# EAGLE design qi-charger (EAGLE 9.6.2)
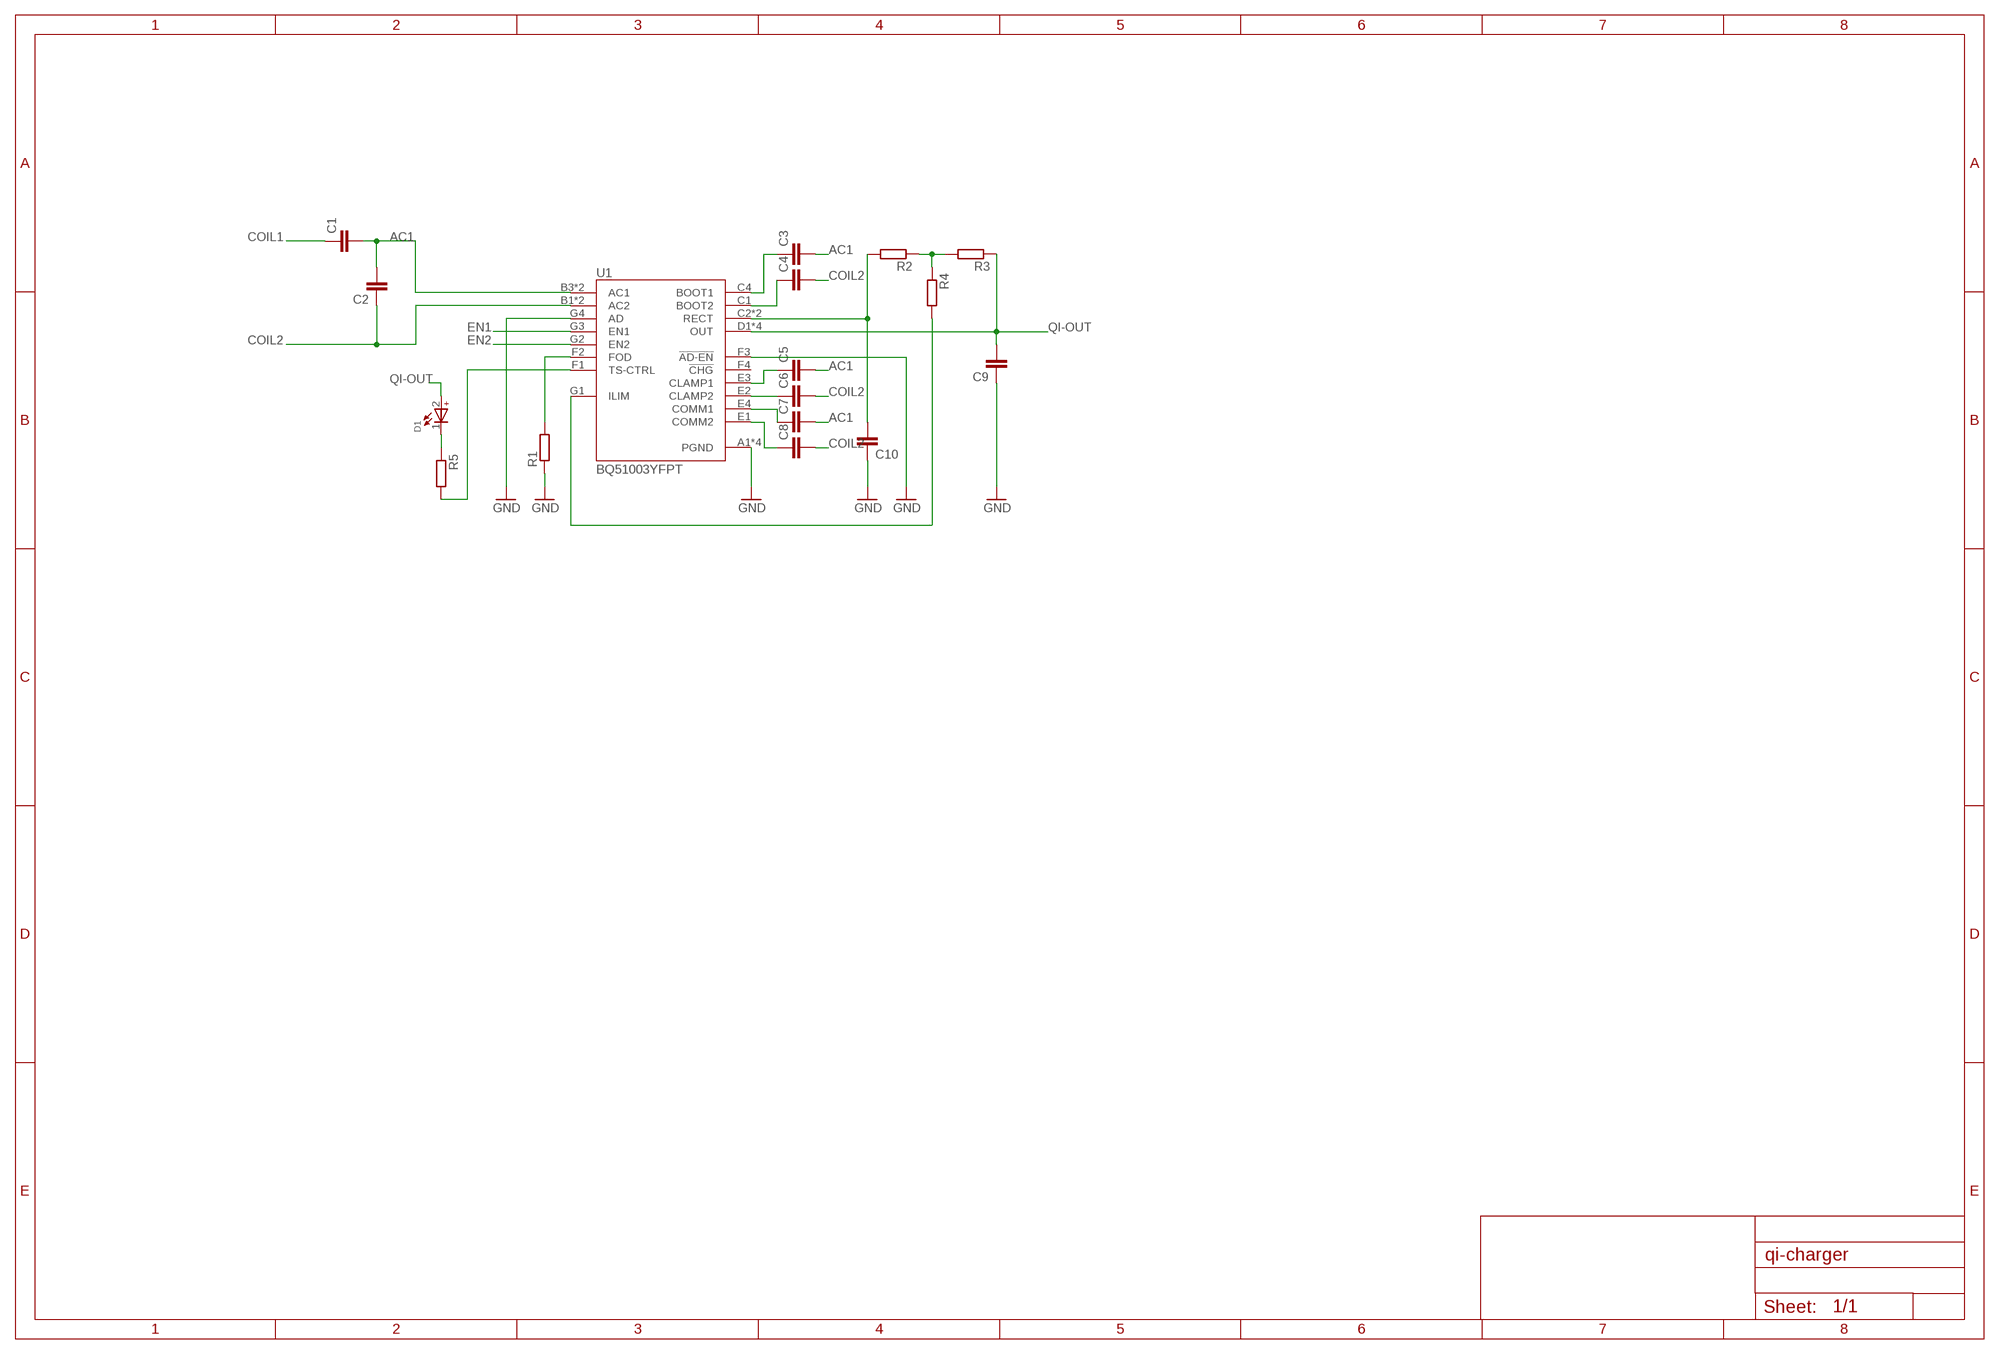
[diagram p0: schematic, sheet 1]

## Parts
C1  C-EUC0805  [C0805]
C2  C-EUC0805  [C0805]
C3  C-EUC0805  [C0805]
C4  C-EUC0805  [C0805]
C5  C-EUC0805  [C0805]
C6  C-EUC0805  [C0805]
C7  C-EUC0805  [C0805]
C8  C-EUC0805  [C0805]
C9  C-EUC0805  [C0805]
C10  C-EUC0805  [C0805]
D1  WL-SMCW_0603_150060AS75000  [WL-SMCW_0603]
R1  R-EU_M0805  [M0805]
R2  R-EU_M0805  [M0805]
R3  R-EU_M0805  [M0805]
R4  R-EU_M0805  [M0805]
R5  R-EU_M0805  [M0805]
U1  BQ51003YFPT  [BGA28N40P7X4_300X188X50N]

## Nets
AC1: C1.2 C2.2 C3.2 C5.2 C7.2 U1.B3(AC1) U1.B4(AC1)
COIL1: C1.1
COIL2: C2.1 C4.2 C6.2 C8.2 U1.B1(AC2) U1.B2(AC2)
EN1: U1.G3(EN1)
EN2: U1.G2(EN2)
GND: C9.1 C10.1 R1.1 U1.A1(PGND) U1.A2(PGND) U1.A3(PGND) U1.A4(PGND) U1.F3(!AD-EN) U1.G4(AD)
N$1: R1.2 U1.F2(FOD)
N$4: C3.1 U1.C4(BOOT1)
N$5: C4.1 U1.C1(BOOT2)
N$6: C5.1 U1.E3(CLAMP1)
N$7: C6.1 U1.E2(CLAMP2)
N$8: C7.1 U1.E4(COMM1)
N$9: C8.1 U1.E1(COMM2)
N$11: C10.2 R2.2 U1.C2(RECT) U1.C3(RECT)
N$12: R2.1 R3.2 R4.1
N$13: R4.2 U1.G1(ILIM)
N$14: R5.2 U1.F1(TS-CTRL)
N$15: D1.1(-) R5.1
QI-OUT: C9.2 D1.2(+) R3.1 U1.D1(OUT) U1.D2(OUT) U1.D3(OUT) U1.D4(OUT)
Unconnected: U1.F4(!CHG)

## Library data of the parts
C1-C10 = rcl:C-EU: CAPACITOR, European symbol; SPICEPREFIX: C
D1 = 150120GS75000_Eagle_WL-SMCW_rev20b:WL-SMCW_0603: WL-SMCW SMT Mono-color Chip LED Waterclea Characteristics Low energy consumption High reliability Low current requirement Fast switching No UV/IR radiation Smallest SMD LED package for exceptional brightness Top view LED Wide viewing angle Better solder ability Heat dissipation Applications Backlight for mobile and portable device keypads Indoor and outdoor message boards Flat backlight for LCDs, switches and symbols Display for industrial control systems and traffic Miniaturized color effects Pedestrian mark Optical indicators Tabular backlight: LCD, telephone key-press, power-switch, display board Indoor displays Signals Identifiers Backlight for automobile DVD LED General lighting Toys <https://www.we-online.com/catalog/media/o14904v209%20Family_WL-SMCW.jpg> Details see: https://www.we-online.com/catalog/en/WL-SMCW/ Updated BY Yingchun,Shan 2020-03-18 2020(C) Wurth Elektronik; ABSTRAHLWINKEL: 140°; CHIP-TECHNOLOGY: AlInGaP; DATASHEET-URL: https://www.we-online.com/catalog/datasheet/150060AS75000.pdf; EMITTING-COLOR: Amber; I-V-TYP: 130mcd; LAMDA-DOM-TYP: 605nm; LAMDA-PEAK-TYP: 610nm; PART-NUMBER: 150060AS75000; V-F-TYP: 2V
R1-R5 = rcl:R-EU_: RESISTOR, European symbol; SPICEPREFIX: R
U1 = BQ51003YFPT:BQ51003YFPT: IC WIRELESS PWR RCVR 28DSBGA; AVAILABILITY: Unavailable; DESCRIPTION: BQ51003 Wireless power Receiver; DIGIKEY-PURCHASE-URL: https://snapeda.com/shop?store=DigiKey&id=230241; MF: Texas Instruments; MOUSER-PURCHASE-URL: https://snapeda.com/shop?store=Mouser&id=230241; MP: BQ51003YFPT; PACKAGE: DSBGA-28 Texas Instruments; PRICE: None; TEXAS_INSTRUMENTS-PURCHASE-URL: https://snapeda.com/shop?store=Texas+Instruments&id=230241

## Board
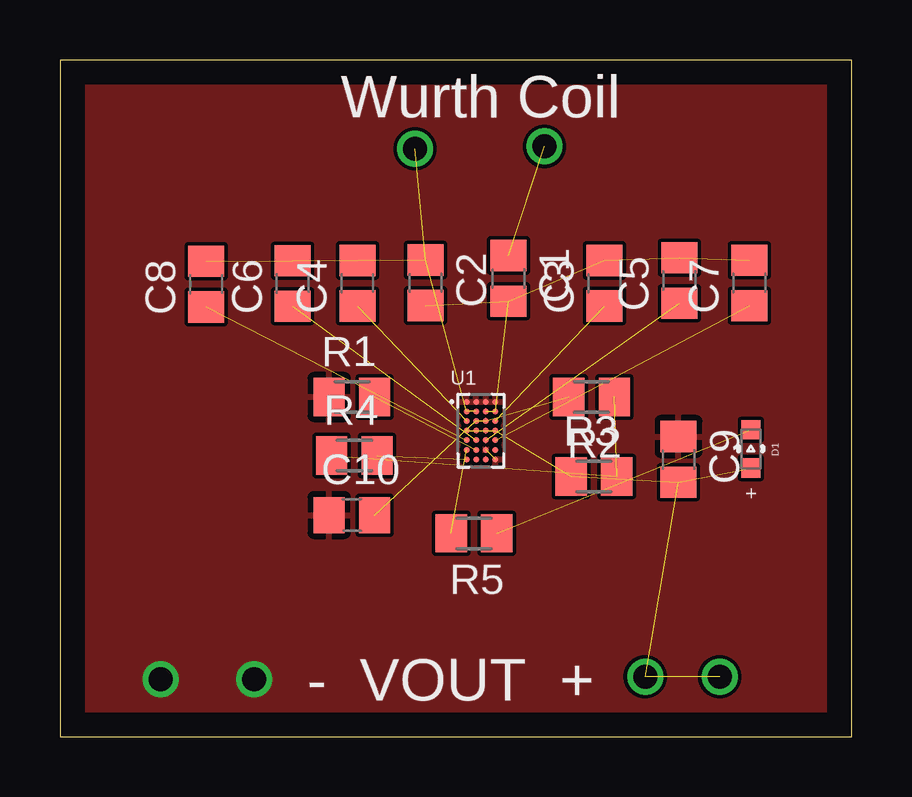
[diagram p1: board, top side]

Size 33 x 28.2 mm. Coordinates in mm from the lower left corner, seen from the top.
Outline: 0,0 33,0 33,28.2 0,28.2 0,0
Copper layers (1*16): Top 0.035mm / dielectric 1.5mm / Bottom 0.035mm
Design rules "default": minimum track width 6mil, minimum drill 0.35mm, track to track 6mil, track to pad 6mil, pad to pad 6mil, via to via 6mil, smd to smd 6mil, copper to edge 40mil, drill to drill 6mil, minimum pad ring 10mil, minimum via ring 8mil, stop-mask expansion 4mil, vias tented up to drill 0mil, thermal gap 10mil

### Footprints (pad centres in the part's own frame; a part is rotated, then mirrored left to right if it is on the bottom)
C0805 = smd 1.3 x 1.5: 1 -0.95,0; 2 0.95,0
WL-SMCW_0603 = smd 0.8 x 0.8: 1 -0.8,0; 2 0.8,0
M0805 = smd 1.3 x 1.6: 1 -0.95,0; 2 0.95,0
BGA28N40P7X4_300X188X50N = smd 0.25 x 0.25: A1 -0.6,1.2; A2 -0.2,1.2; A3 0.2,1.2; A4 0.6,1.2; B1 -0.6,0.8; B2 -0.2,0.8; B3 0.2,0.8; B4 0.6,0.8; C1 -0.6,0.4; C2 -0.2,0.4; C3 0.2,0.4; C4 0.6,0.4; D1 -0.6,0; D2 -0.2,0; D3 0.2,0; D4 0.6,0; E1 -0.6,-0.4; E2 -0.2,-0.4; E3 0.2,-0.4; E4 0.6,-0.4; F1 -0.6,-0.8; F2 -0.2,-0.8; F3 0.2,-0.8; F4 0.6,-0.8; G1 -0.6,-1.2; G2 -0.2,-1.2; G3 0.2,-1.2; G4 0.6,-1.2

### Placement (x,y rotation side)
C1  18.7,19.1 270 top
C2  15.24,18.92 270 top
C3  22.7,18.9 90 top
C4  12.4,18.9 90 top
C5  25.82,19.01 90 top
C6  9.7,18.89 90 top
C7  28.74,18.91 90 top
C8  6.09,18.86 90 top
C9  25.79,11.56 270 top
C10  12.17,9.24 0 top
D1  28.8,12 270 top
R1  12.17,14.16 0 top
R2  22.16,14.16 180 top
R3  22.26,10.85 0 top
R4  12.27,11.72 0 top
R5  17.26,8.48 180 top
U1  17.55,12.76 0 top

### Tracks (layer width: path | path; a pad name or v marks a point on that pad's centre or on a via)
AC1  (6 unrouted)
COIL1  (via drill 1)  (1 unrouted)
  other vias: 20.2,24.6
COIL2  (via drill 1)  (6 unrouted)
  other vias: 14.8,24.5
GND  (via drill 1)  (1 unrouted)
  other vias: 8.1,2.4 4.2,2.4
  pour Top: -2.54,68.58 36.83,68.58 36.83,-5.08 -2.54,-5.08
N$1  (1 unrouted)
N$4  (1 unrouted)
N$5  (1 unrouted)
N$6  (1 unrouted)
N$7  (1 unrouted)
N$8  (1 unrouted)
N$9  (1 unrouted)
N$11  (3 unrouted)
N$12  (2 unrouted)
N$13  (1 unrouted)
N$14  (1 unrouted)
N$15  (1 unrouted)
QI-OUT  (via drill 1)  (8 unrouted)
  other vias: 27.5,2.5 24.4,2.5

### Text on the board
tPlace: Wurth Coil | - VOUT +